# EAGLE schematic teensyMotors02_upSwitch (EAGLE 9.1.3)
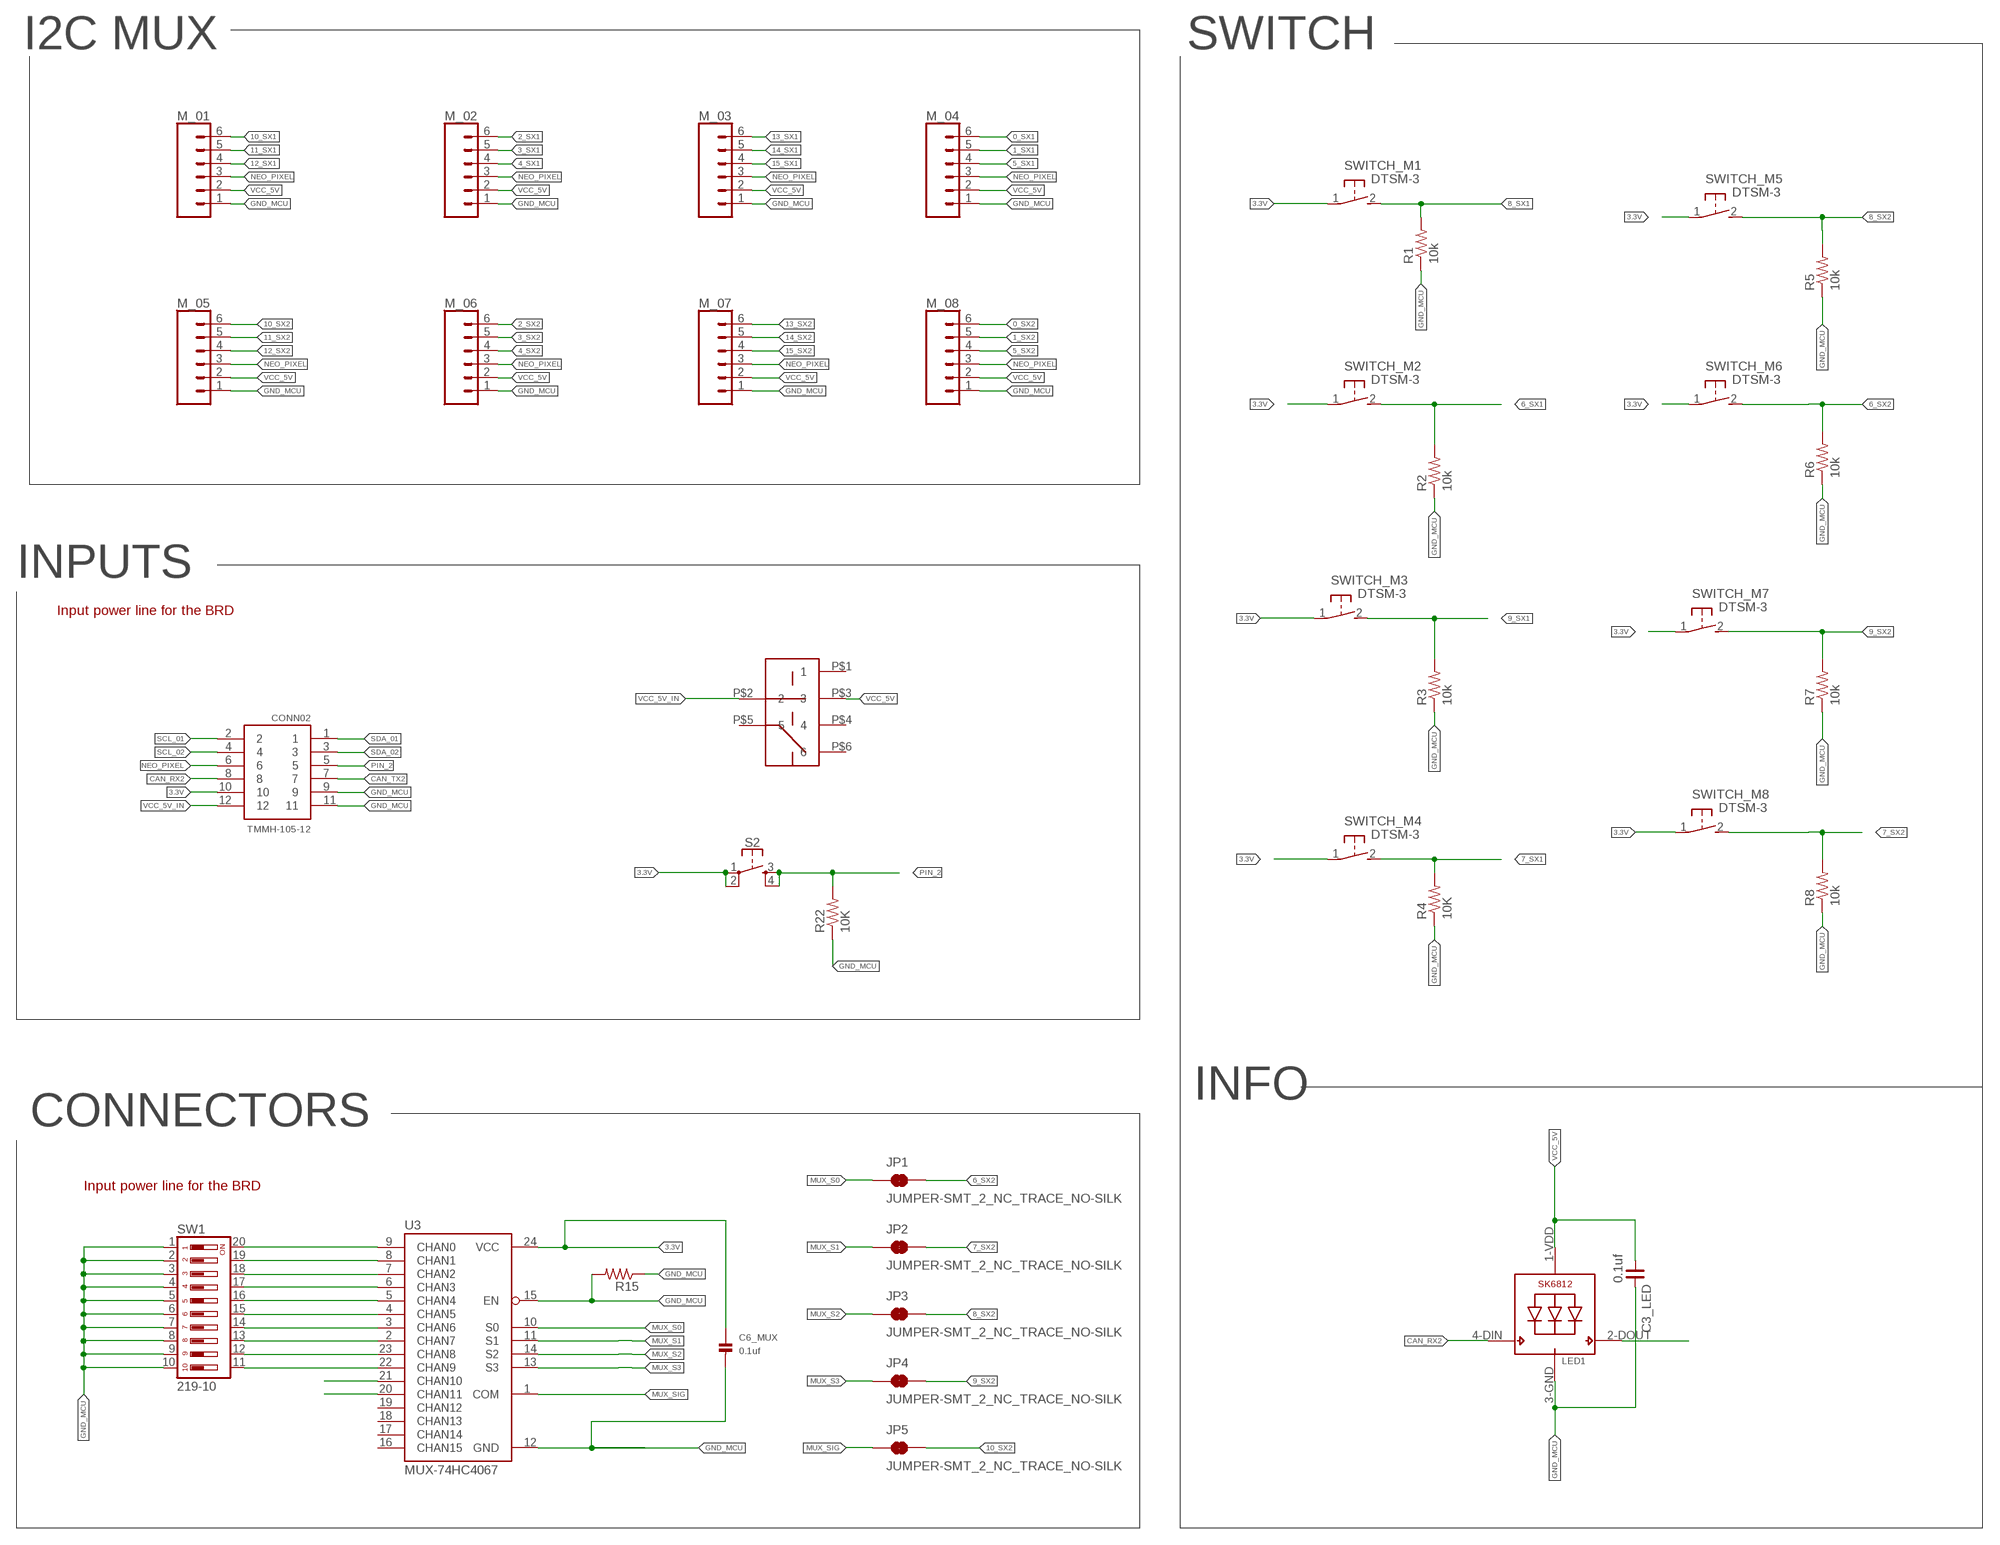
[diagram p0: schematic, sheet 1, part 1 of 2]
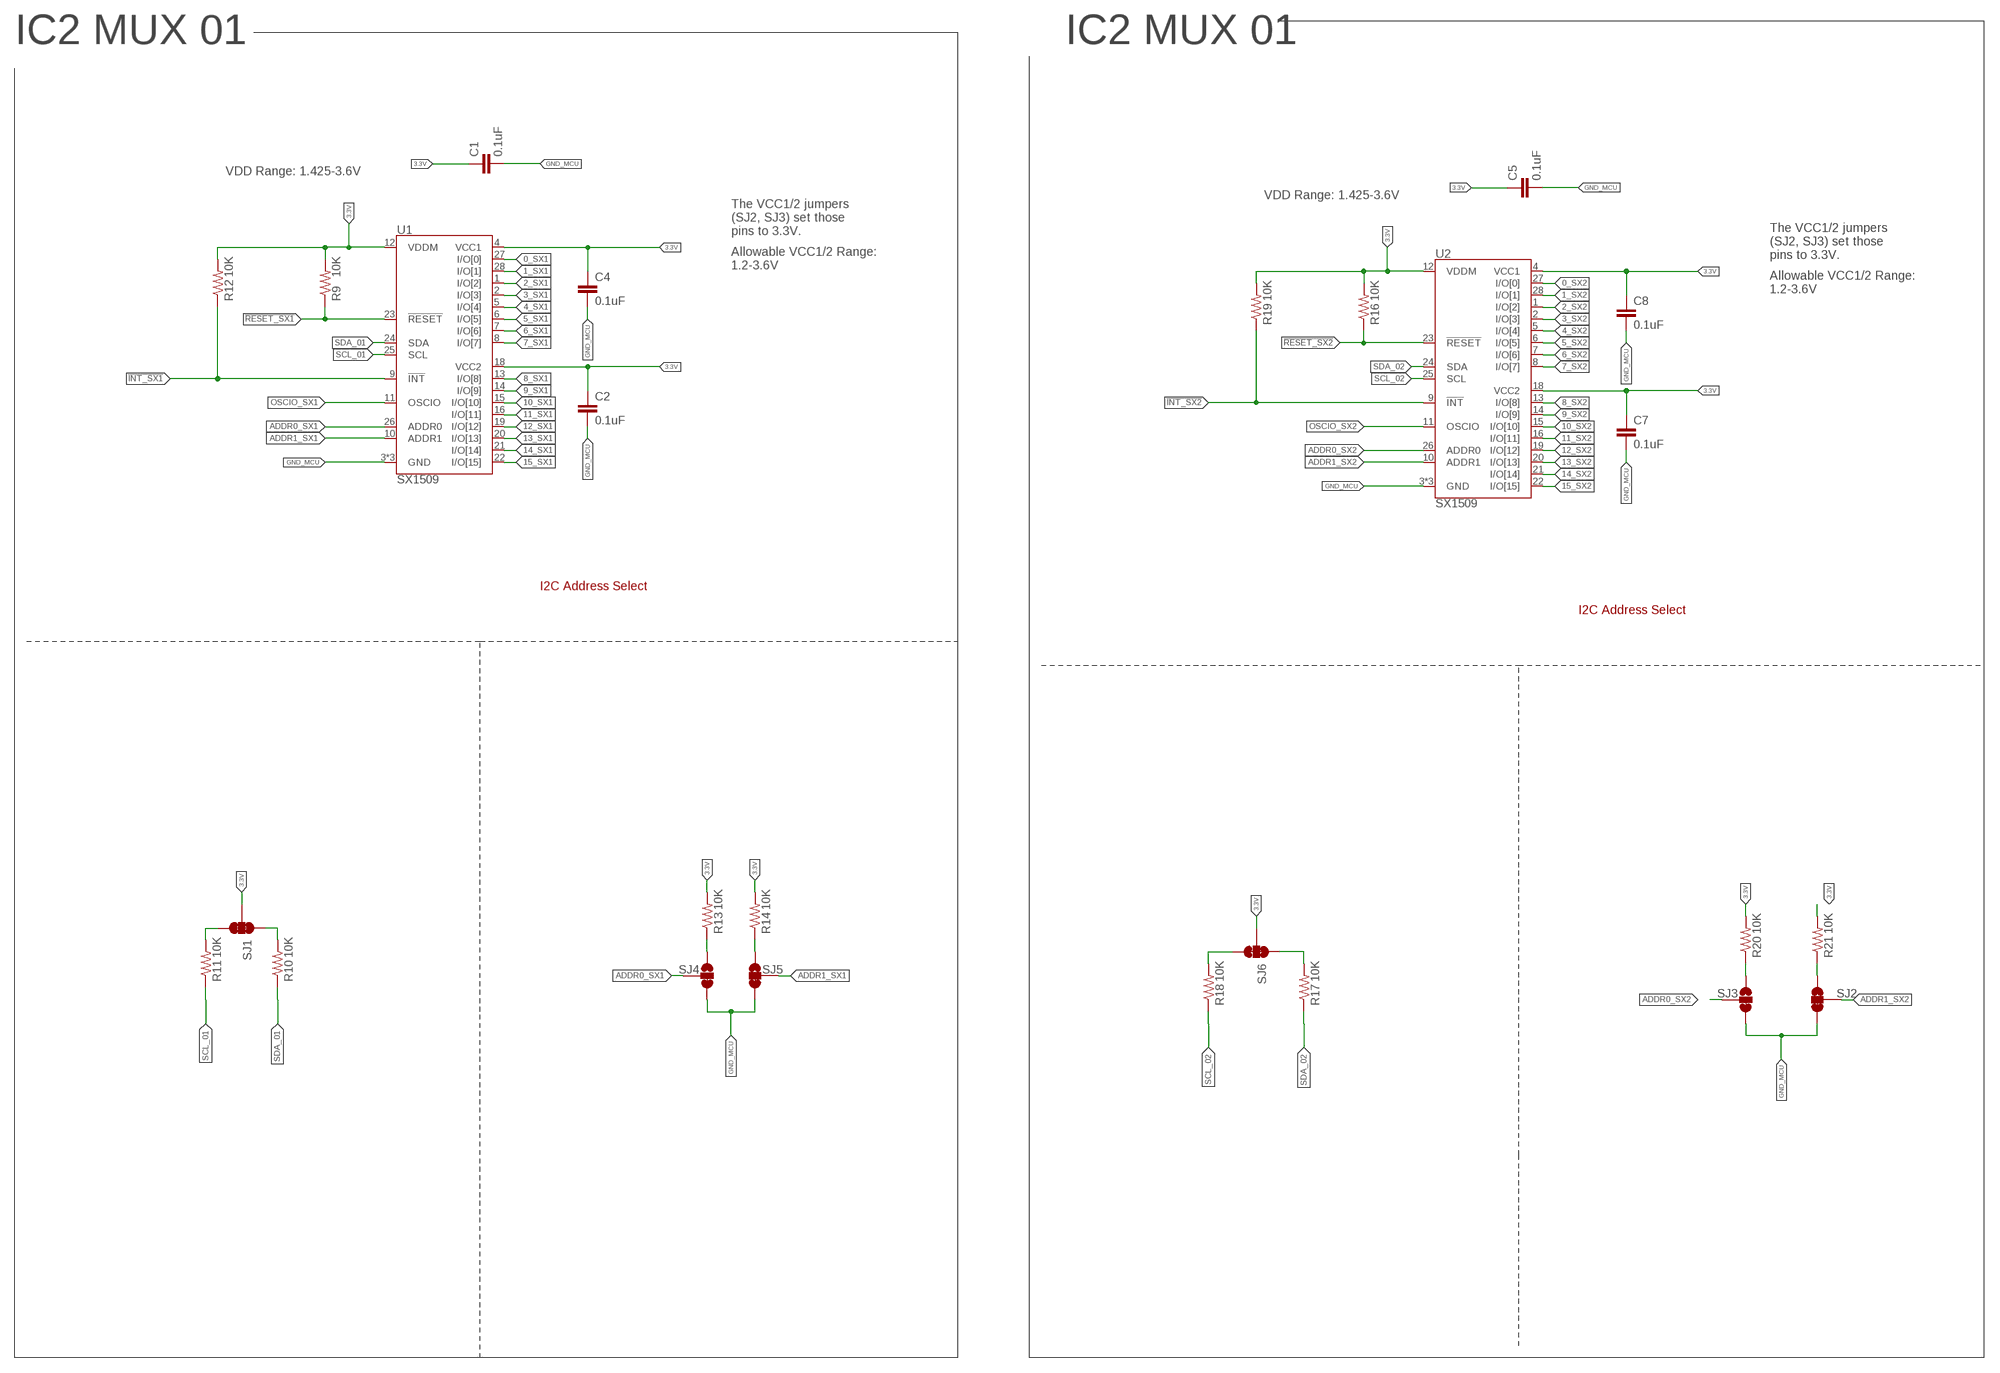
[diagram p1: schematic, sheet 1, part 2 of 2]

## Parts
C1  0.1uF  0.1UF-25V(+80/-20%)(0603)  [0603-CAP]
C2  0.1uF  0.1UF-25V(+80/-20%)(0603)  [0603-CAP]
C3_LED  0.1uf  C_0805  [C0805]
C4  0.1uF  0.1UF-25V(+80/-20%)(0603)  [0603-CAP]
C5  0.1uF  0.1UF-25V(+80/-20%)(0603)  [0603-CAP]
C6_MUX  0.1uf  CAP_CERAMIC0805  [0805]
C7  0.1uF  0.1UF-25V(+80/-20%)(0603)  [0603-CAP]
C8  0.1uF  0.1UF-25V(+80/-20%)(0603)  [0603-CAP]
CONN02  TMMH-105-12  [TMMH-105-12]
JP1  JUMPER-SMT_2_NC_TRACE_NO-SILK  [SMT-JUMPER_2_NC_TRACE_NO-SILK]
JP2  JUMPER-SMT_2_NC_TRACE_NO-SILK  [SMT-JUMPER_2_NC_TRACE_NO-SILK]
JP3  JUMPER-SMT_2_NC_TRACE_NO-SILK  [SMT-JUMPER_2_NC_TRACE_NO-SILK]
JP4  JUMPER-SMT_2_NC_TRACE_NO-SILK  [SMT-JUMPER_2_NC_TRACE_NO-SILK]
JP5  JUMPER-SMT_2_NC_TRACE_NO-SILK  [SMT-JUMPER_2_NC_TRACE_NO-SILK]
LED1  SK6812_5050N  [LED5050_N]
M_01  CONN_06SMD-1MM  [1X06-1MM]
M_02  CONN_06SMD-1MM  [1X06-1MM]
M_03  CONN_06SMD-1MM  [1X06-1MM]
M_04  CONN_06SMD-1MM  [1X06-1MM]
M_05  CONN_06SMD-1MM  [1X06-1MM]
M_06  CONN_06SMD-1MM  [1X06-1MM]
M_07  CONN_06SMD-1MM  [1X06-1MM]
M_08  CONN_06SMD-1MM  [1X06-1MM]
R1  10k  R-US_M0805  [M0805]
R2  10k  R-US_M0805  [M0805]
R3  10k  R-US_M0805  [M0805]
R4  10K  R-US_M0805  [M0805]
R5  10k  R-US_M0805  [M0805]
R6  10k  R-US_M0805  [M0805]
R7  10k  R-US_M0805  [M0805]
R8  10k  R-US_M0805  [M0805]
R9  10K  10KOHM-1/10W-1%(0603)0603  [0603-RES]
R10  10K  10KOHM-1/10W-1%(0603)0603  [0603-RES]
R11  10K  10KOHM-1/10W-1%(0603)0603  [0603-RES]
R12  10K  10KOHM-1/10W-1%(0603)0603  [0603-RES]
R13  10K  10KOHM-1/10W-1%(0603)0603  [0603-RES]
R14  10K  10KOHM-1/10W-1%(0603)0603  [0603-RES]
R15  R-US_M0805  [M0805]
R16  10K  10KOHM-1/10W-1%(0603)0603  [0603-RES]
R17  10K  10KOHM-1/10W-1%(0603)0603  [0603-RES]
R18  10K  10KOHM-1/10W-1%(0603)0603  [0603-RES]
R19  10K  10KOHM-1/10W-1%(0603)0603  [0603-RES]
R20  10K  10KOHM-1/10W-1%(0603)0603  [0603-RES]
R21  10K  10KOHM-1/10W-1%(0603)0603  [0603-RES]
R22  10K  R-US_M0805  [M0805]
S2  MOMENTARY-SWITCH-SPST-2-SMD-5.2MM  [TACTILE_SWITCH_SMD_5.2MM]
SJ1  JUMPER-PAD-3-NC_BY_TRACE  [PAD-JUMPER-3-3OF3_NC_BY_TRACE_YES_SILK_FULL_BOX]
SJ2  JUMPER-PAD-3-2OF3_NC_BY_TRACE_SMALL  [PAD-JUMPER-3-2OF3_NC_BY_TRACE_YES_SILK_FULL_BOX]
SJ3  JUMPER-PAD-3-2OF3_NC_BY_TRACE_SMALL  [PAD-JUMPER-3-2OF3_NC_BY_TRACE_YES_SILK_FULL_BOX]
SJ4  JUMPER-PAD-3-2OF3_NC_BY_TRACE_SMALL  [PAD-JUMPER-3-2OF3_NC_BY_TRACE_YES_SILK_FULL_BOX]
SJ5  JUMPER-PAD-3-2OF3_NC_BY_TRACE_SMALL  [PAD-JUMPER-3-2OF3_NC_BY_TRACE_YES_SILK_FULL_BOX]
SJ6  JUMPER-PAD-3-NC_BY_TRACE  [PAD-JUMPER-3-3OF3_NC_BY_TRACE_YES_SILK_FULL_BOX]
SW1  219-10  [CTS-219-10]
SWITCH_M1  DTSM-3  [DTSM-3]
SWITCH_M2  DTSM-3  [DTSM-3]
SWITCH_M3  DTSM-3  [DTSM-3]
SWITCH_M4  DTSM-3  [DTSM-3]
SWITCH_M5  DTSM-3  [DTSM-3]
SWITCH_M6  DTSM-3  [DTSM-3]
SWITCH_M7  DTSM-3  [DTSM-3]
SWITCH_M8  DTSM-3  [DTSM-3]
U1  SX1509  [QFN-28]
U2  SX1509  [QFN-28]
U3  MUX-74HC4067  MUX-74HC4067SMD  [SSOP24]
U$1  MFS201N－9－Z  [MFS201N－9－Z]

## Nets
0_SX1: M_04.6 U1.27(I/O[0])
0_SX2: M_08.6 U2.27(I/O[0])
1_SX1: M_04.5 U1.28(I/O[1])
1_SX2: M_08.5 U2.28(I/O[1])
2_SX1: M_02.6 U1.1(I/O[2])
2_SX2: M_06.6 U2.1(I/O[2])
3.3V: C1.1 C2.1 C4.1 C5.1 C6_MUX.1 C7.1 C8.1 CONN02.10 R9.2 R12.2 R13.2 R14.2 R16.2 R19.2 R20.2 R21.2 S2.1 S2.2 SJ1.2 SJ6.2 SWITCH_M1.1 SWITCH_M2.1 SWITCH_M3.1 SWITCH_M4.1 SWITCH_M5.1 SWITCH_M6.1 SWITCH_M7.1 SWITCH_M8.1 U1.4(VCC1) U1.12(VDDM) U1.18(VCC2) U2.4(VCC1) U2.12(VDDM) U2.18(VCC2) U3.24(VCC)
3_SX1: M_02.5 U1.2(I/O[3])
3_SX2: M_06.5 U2.2(I/O[3])
4_SX1: M_02.4 U1.5(I/O[4])
4_SX2: M_06.4 U2.5(I/O[4])
5_SX1: M_04.4 U1.6(I/O[5])
5_SX2: M_08.4 U2.6(I/O[5])
6_SX1: R2.2 SWITCH_M2.2 U1.7(I/O[6])
6_SX2: JP1.2 R6.2 SWITCH_M6.2 U2.7(I/O[6])
7_SX1: R4.2 SWITCH_M4.2 U1.8(I/O[7])
7_SX2: JP2.2 R8.2 SWITCH_M8.2 U2.8(I/O[7])
8_SX1: R1.2 SWITCH_M1.2 U1.13(I/O[8])
8_SX2: JP3.2 R5.2 SWITCH_M5.2 U2.13(I/O[8])
9_SX1: R3.2 SWITCH_M3.2 U1.14(I/O[9])
9_SX2: JP4.2 R7.2 SWITCH_M7.2 U2.14(I/O[9])
10_SX1: M_01.6 U1.15(I/O[10])
10_SX2: JP5.2 M_05.6 U2.15(I/O[10])
11_SX1: M_01.5 U1.16(I/O[11])
11_SX2: M_05.5 U2.16(I/O[11])
12_SX1: M_01.4 U1.19(I/O[12])
12_SX2: M_05.4 U2.19(I/O[12])
13_SX1: M_03.6 U1.20(I/O[13])
13_SX2: M_07.6 U2.20(I/O[13])
14_SX1: M_03.5 U1.21(I/O[14])
14_SX2: M_07.5 U2.21(I/O[14])
15_SX1: M_03.4 U1.22(I/O[15])
15_SX2: M_07.4 U2.22(I/O[15])
!INT_SX1: R12.1 U1.9(!INT)
!INT_SX2: R19.1 U2.9(!INT)
!RESET_SX1: R9.1 U1.23(!RESET)
!RESET_SX2: R16.1 U2.23(!RESET)
ADDR0_SX1: SJ4.2 U1.26(ADDR0)
ADDR0_SX2: SJ3.2 U2.26(ADDR0)
ADDR1_SX1: SJ5.2 U1.10(ADDR1)
ADDR1_SX2: SJ2.2 U2.10(ADDR1)
C0: SW1.20 U3.9(CHAN0)
C1: SW1.19 U3.8(CHAN1)
C2: SW1.18 U3.7(CHAN2)
C3: SW1.17 U3.6(CHAN3)
C4: SW1.16 U3.5(CHAN4)
C5: SW1.15 U3.4(CHAN5)
C6: SW1.14 U3.3(CHAN6)
C7: SW1.13 U3.2(CHAN7)
C8: SW1.12 U3.23(CHAN8)
C9: SW1.11 U3.22(CHAN9)
CAN_RX2: CONN02.8 LED1.4-DIN(DI)
CAN_TX2: CONN02.7
GND_MCU: C1.2 C2.2 C3_LED.2 C4.2 C5.2 C6_MUX.2 C7.2 C8.2 CONN02.9 CONN02.11 LED1.3-GND(GND) M_01.1 M_02.1 M_03.1 M_04.1 M_05.1 M_06.1 M_07.1 M_08.1 R1.1 R2.1 R3.1 R4.1 R5.1 R6.1 R7.1 R8.1 R15.1 R15.2 R22.1 SJ2.3 SJ3.3 SJ4.3 SJ5.3 SW1.1 SW1.2 SW1.3 SW1.4 SW1.5 SW1.6 SW1.7 SW1.8 SW1.9 SW1.10 U1.3(GND) U1.17(GND) U1.29(GND) U2.3(GND) U2.17(GND) U2.29(GND) U3.12(GND) U3.15(EN)
MUX_S0: JP1.1 U3.10(S0)
MUX_S1: JP2.1 U3.11(S1)
MUX_S2: JP3.1 U3.14(S2)
MUX_S3: JP4.1 U3.13(S3)
MUX_SIG: JP5.1 U3.1(COM)
N$1: U3.21(CHAN10)
N$2: R11.2 SJ1.3
N$3: R18.2 SJ6.3
N$4: R17.2 SJ6.1
N$5: R20.1 SJ3.1
N$6: R21.1 SJ2.1
N$7: R10.2 SJ1.1
N$8: R13.1 SJ4.1
N$9: U3.20(CHAN11)
N$10: R14.1 SJ5.1
N$13: LED1.2-DOUT(DO)
NEO_PIXEL: CONN02.6 M_01.3 M_02.3 M_03.3 M_04.3 M_05.3 M_06.3 M_07.3 M_08.3
OSCIO_SX1: U1.11(OSCIO)
OSCIO_SX2: U2.11(OSCIO)
PIN_2: CONN02.5 R22.2 S2.3 S2.4
SCL_01: CONN02.2 R11.1 U1.25(SCL)
SCL_02: CONN02.4 R18.1 U2.25(SCL)
SDA_01: CONN02.1 R10.1 U1.24(SDA)
SDA_02: CONN02.3 R17.1 U2.24(SDA)
VCC_5V [5v]: C3_LED.1 LED1.1-VDD(VDD) M_01.2 M_02.2 M_03.2 M_04.2 M_05.2 M_06.2 M_07.2 M_08.2 U$1.P$3
VCC_5V_IN [5v]: CONN02.12 U$1.P$2
Unconnected: U3.16(CHAN15) U3.17(CHAN14) U3.18(CHAN13) U3.19(CHAN12) U$1.P$1 U$1.P$4 U$1.P$5 U$1.P$6

## Notes on the sheet
- I2C MUX | SWITCH | IC2 MUX 01 | IC2 MUX 01
- VDD Range: 1.425-3.6V
- VDD Range: 1.425-3.6V
- The VCC1/2 jumpers 
  (SJ2, SJ3) set those 
  pins to 3.3V.
- Allowable VCC1/2 Range: 
  1.2-3.6V
- The VCC1/2 jumpers 
  (SJ2, SJ3) set those 
  pins to 3.3V.
- Allowable VCC1/2 Range: 
  1.2-3.6V
- INPUTS
- Input power line for the BRD
- I2C Address Select
- I2C Address Select
- INFO
- CONNECTORS
- Input power line for the BRD

## Library data of the parts
C1 C2 C4 C5 C7 C8 = SparkFun-Capacitors:0.1UF-25V(+80/-20%)(0603): CAP-00810 Ceramic Standard decoupling cap; PROD_ID: CAP-00810
C3_LED = rc-master-smd:C_: NON-POLARIZED CAP
C6_MUX = microbuilder:CAP_CERAMIC: Ceramic Capacitors 0402 - 0402 Surface Mount Capacitors 16pF 50V 5% [Digikey: 445-4899-2-ND] 18pF 50V 5% [Digikey: 490-1281-2-ND] 22pF 50V 5% [Digikey: 490-1283-2-ND] 68pF 50V 5% [Digikey: 490-1289-2-ND] 0.1uF 10V 10% [Digikey: 490-1318-2-ND] 1.0uF 6.3V 10% [Digikey: 490-1320-2-ND] 0603 - 0603 Surface Mount Capacitors 16 pF 50V 5% [Digikey: 445-5051-2-ND] 22 pF 50V [Digikey: PCC220ACVTR-ND] 33 pF 50V 5% [Digikey: 490-1415-1-ND] 56pF 50V 5% [Digikey: 490-1421-1-ND] 220pF 50V 5% [Digikey: 445-1285-1-ND] 680 pF 50V 2200 pF 50V 5% C0G [Digikey: 445-1297-1-ND] 5600 pF 100V 5% X7R [Digikey: 478-3711-1-ND] 0.1 µF 25V 10% [Digikey: PCC2277TR-ND] 0.22 µF 16V 10% X7R [Digikey: 445-1318-1-ND] 1.0 µF 25V 10% [Digikey: 445-5146-2-ND] 0603 - RF Specific 3pF 250V +/-0.1pF RF [Digikey: 712-1347-1-ND] 18 pF 250V 5% [Digikey: 478-3505-1-ND or 712-1322-1-ND] 56 pF 250V 5% C0G RF [Digikey: 490-4867-1-ND] 68 pF 250V RF [Digikey: 490-4868-1-ND] 0805 - 0805 Surface Mount Capacitors 220 pF 250V 2% RF Ceramic Capacitor [Digikey: 712-1398-1-ND] 1000 pF 50V 2% NP0 Ceramic Capacitor [Digikey: 478-3760-1-ND] 0.1 µF 25V 10% Ceramic Capacitor [Digikey: PCC1828TR-ND] 1.0 µF 16V 10% Ceramic Capacitor[Digikey: 490-1691-2-ND] 10.0 µF 10V 10% Ceramic Capacitor[Digikey: 709-1228-1-ND] 10.0 uF 16V 10% Ceramic Capacitor [Digikey: 478-5165-2-ND] 47 uF 6.3V 20% Ceramic Capacitor [Digikey: 587-1779-1-ND or 399-5506-1-ND] 1206 - 1206 Surface Mount Capacitors 47uF 10V 20% Ceramic Capacitor [Digikey: 490-5528-1-ND or 399-5508-1-ND or 445-6010-1-ND] 100uF 6.3V -20%, +80% Y5V Ceramic Capacitor (Digikey: 490-4512-1-ND, Mouser: 81-GRM31CF50J107ZE1L)
CONN02 = TMMH-105-XX-XX-DV:TMMH-105-12: 2mm (.0787") Flex Shroud, .020" (.51mm) Square Post Terminal Strip, Surface Mount,10 Pins.
JP1-JP5 = SparkFun-Jumpers:JUMPER-SMT_2_NC_TRACE: Normally closed trace jumper This jumper has a trace between two pads so it's normally closed (NC). Use a razor knife to open the connection. For best results follow the IPC guidelines for cutting traces: Cutout at least 0.063 mm (0.005 in). Remove all loose material to clean up the cut area. Seal the cut with an approved epoxy. Reapply solder to reclose the connection.
LED1 = SK6812:SK6812
M_01-M_08 = SparkFun-Connectors:CONN_06: Multi connection point. Often used as Generic Header-pin footprint for 0.1 inch spaced/style header connections On any of the 0.1 inch spaced packages, you can populate with these: Break Away Headers - Straight <https://www.sparkfun.com/products/116> (PRT-00116) Break Away Male Headers - Right Angle <https://www.sparkfun.com/products/553> (PRT-00553) Female Headers <https://www.sparkfun.com/products/115> (PRT-00115) Break Away Headers - Machine Pin <https://www.sparkfun.com/products/117> (PRT-00117) Break Away Female Headers - Swiss Machine Pin <https://www.sparkfun.com/products/743> (PRT-00743) Arduino Stackable Header - 6 Pin <https://www.sparkfun.com/products/9280> (PRT-09280) For SCREWTERMINALS and SPRING TERMINALS visit here: Screw Terimnals on SparkFun.com <https://www.sparkfun.com/search/results?term=Screw+Terminals> (5mm/3.5mm/2.54mm spacing) This device is also useful as a general connection point to wire up your design to another part of your project. Our various solder wires solder well into these plated through hole pads. Hook-Up Wire - Assortment (Stranded, 22 AWG) <https://www.sparkfun.com/products/11375> (PRT-11375) Hook-Up Wire - Assortment (Solid Core, 22 AWG) <https://www.sparkfun.com/products/11367> (PRT-11367) View the entire wire category on our website here <https://www.sparkfun.com/categories/141>; PROD_ID: CONN-08249; SF_ID: GPS-00579
R1-R8 R15 R22 = resistor:R-US_: RESISTOR, American symbol
R9-R14 R16-R21 = SparkFun-Resistors:10KOHM-1/10W-1%(0603): RES-00824; PROD_ID: RES-00824
S2 = SparkFun-Switches:MOMENTARY-SWITCH-SPST-2: Momentary Switch (Pushbutton) - SPST - Two Circuits Normally-open (NO) SPST momentary switches (buttons, pushbuttons). Schematic symbol includes two switch circuits. Variants SMD-4.6MMX2.8MM - 4.60mm x 2.80mm Tactile Momentary Button Switch - Used on SparkFun SAMD21 Mini Breakout <https://www.sparkfun.com/products/13664> SMD-5.2MM - Mini Pushbutton Switch - SMD <https://www.sparkfun.com/products/8720> - Used on Arduino Pro Mini <https://www.sparkfun.com/products/11114>; PROD_ID: SWCH-08247; SF_SKU: COM-08720
SJ1 SJ6 = SparkFun-Passives:JUMPER-PAD-3-NC_BY_TRACE
SJ2-SJ5 = SparkFun-Passives:JUMPER-PAD-3-2OF3_NC_BY_TRACE
SW1 = switch-dil:219-10*: Surface Mount DIP Switch Series 219 SMT CTS Electronic Components Sourc: www.ctscorp.com; MF: SLI (CML/IDI); MPN: 219-10PK; OC_FARNELL: unknown; OC_NEWARK: 19M0224
SWITCH_M1-SWITCH_M8 = switch-tact:DTSM-3
U1 U2 = SparkFun-DigitalIC:SX1509: Semtech SX1509 The SX1509 is a complete ultra low voltage 1.2V to 3.6V General Purpose parallel Input/Output (GPIO) expanders ideal for low power handheld battery powered equipment. This version comes in a 16-channel configuration and allows easy serial expansion of I/O through a standard 400kHz I2C interface. GPIO devices can provide additional control and monitoring when the microcontroller or chipset has insufficient I/O ports, or in systems where serial communication and control from a remote location is advantageous.; PROD_ID: IC-11311
U3 = SparkFun:MUX-74HC4067
U$1 = MFS_Switches:MFS201N－9－Z

## Net classes
0 default: width 0.2 mm, clearance 0.2 mm
4 5v: width 0.35 mm, clearance 0.2 mm